# Altium schematic sheet _i2c1.SchDoc
size Tabloid
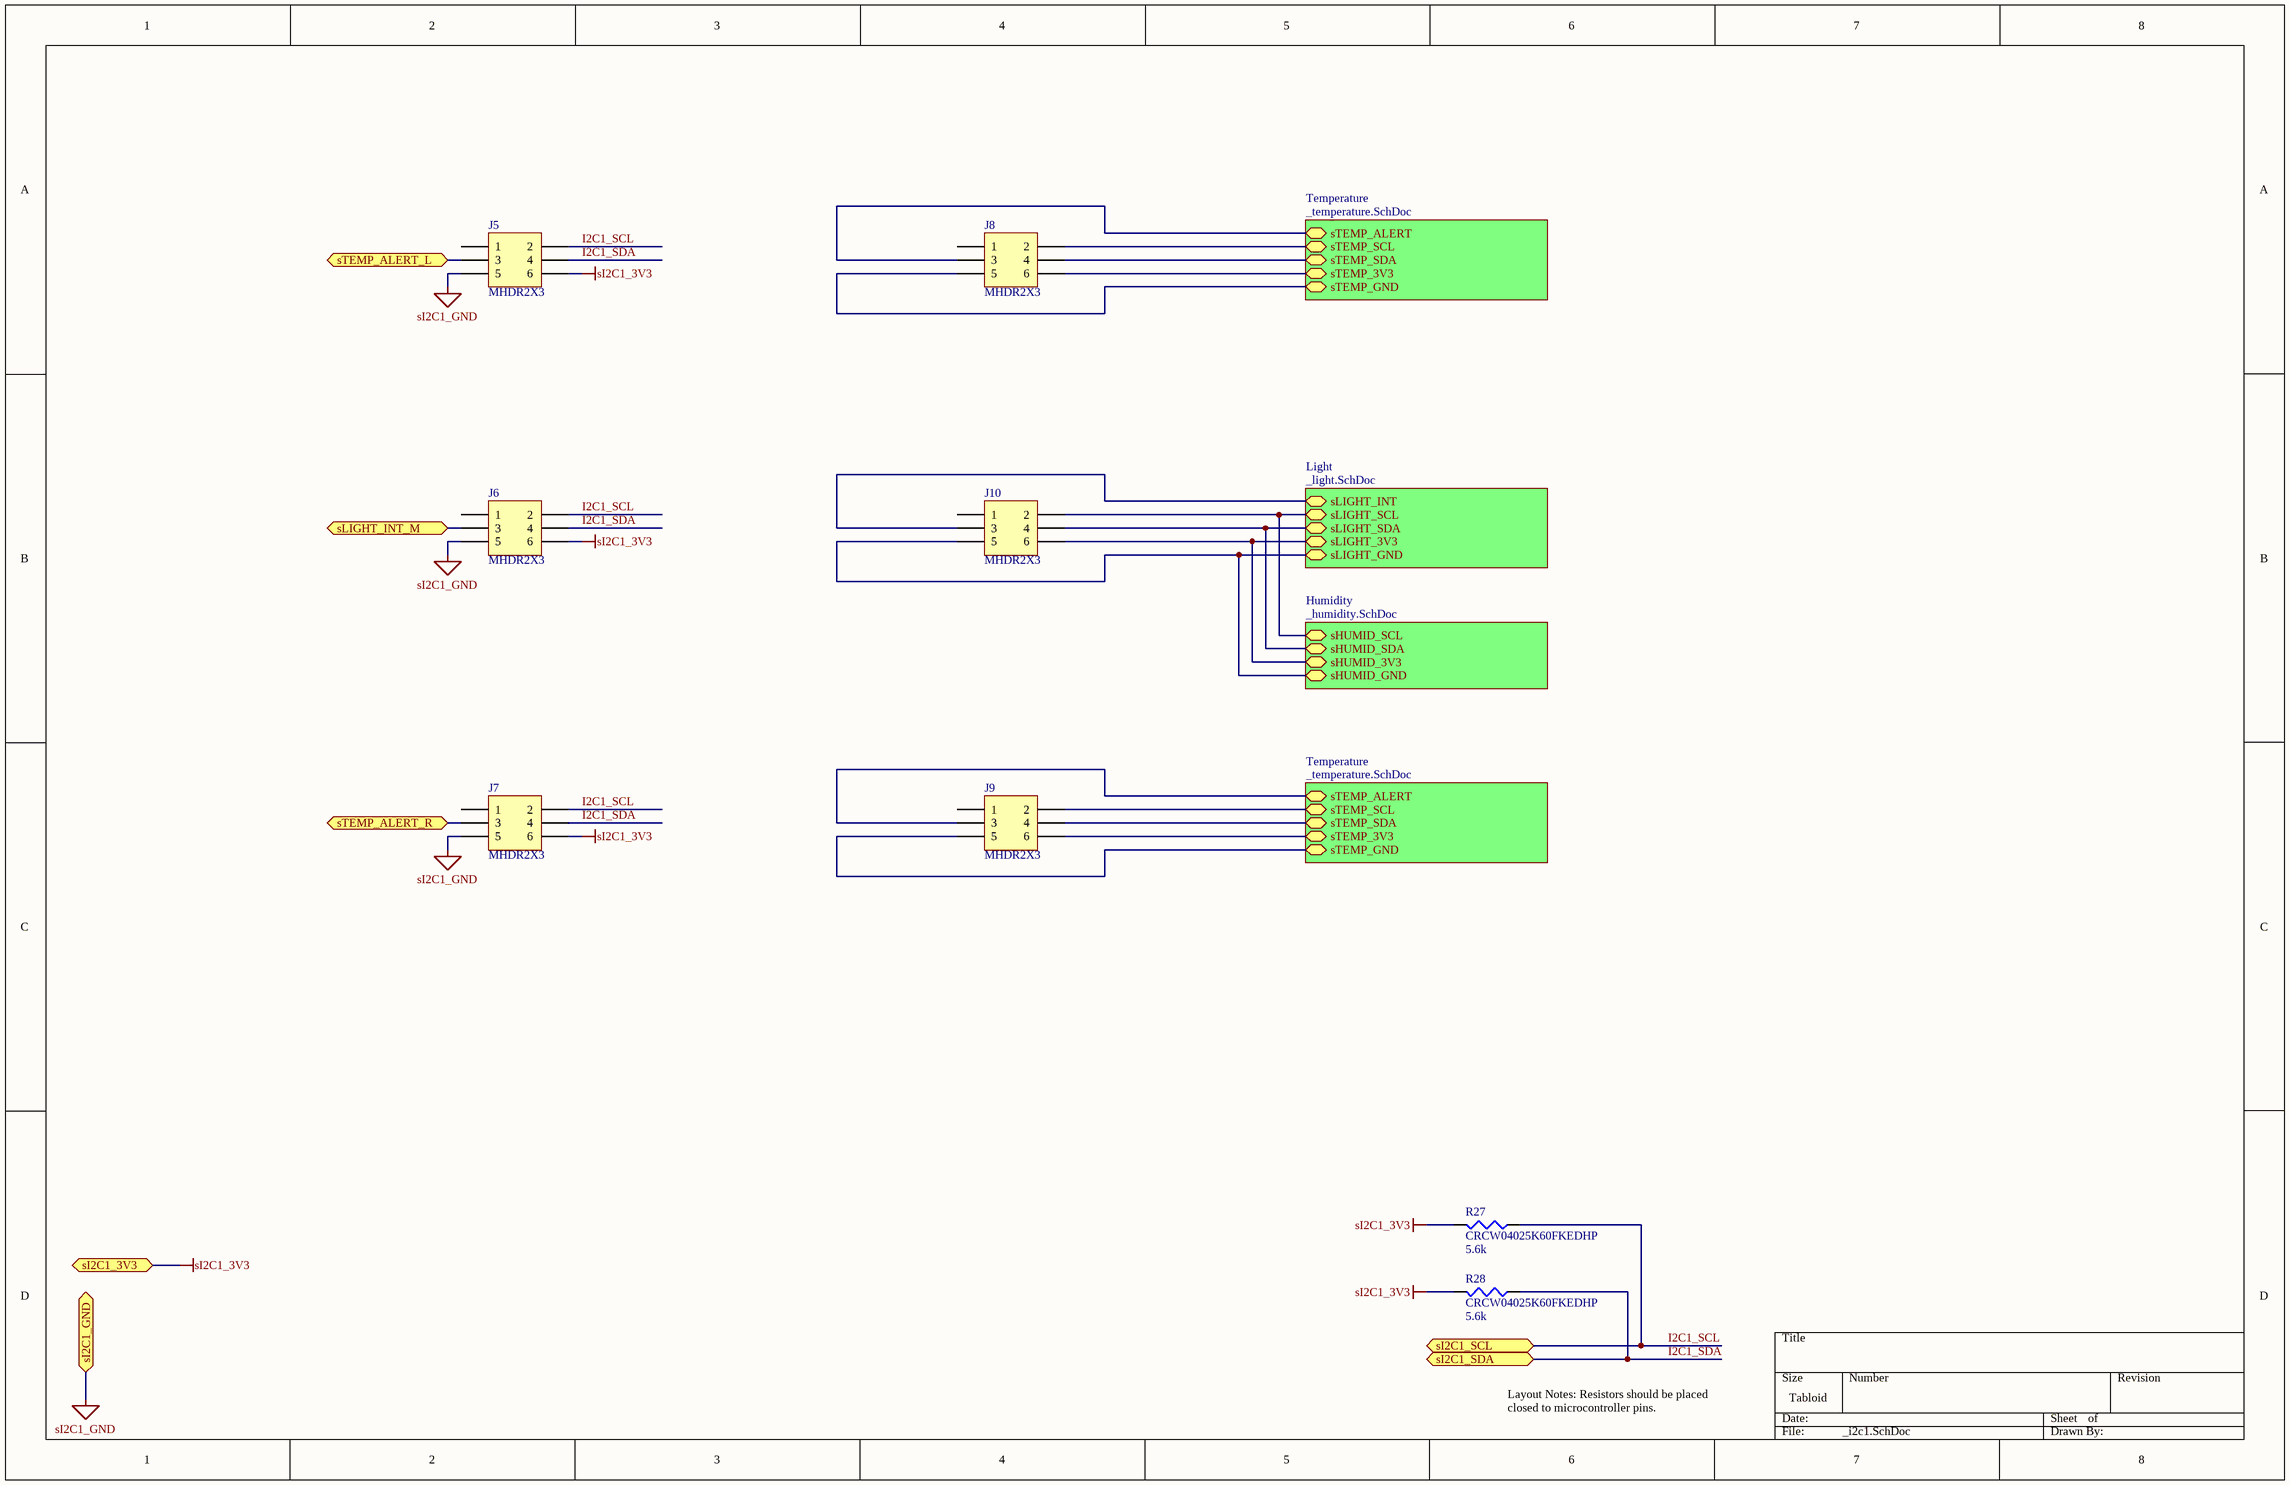
[diagram p0: _i2c1.SchDoc]

## Parts
J5  MHDR2X3  [MHDR2X3]
J6  MHDR2X3  [MHDR2X3]
J7  MHDR2X3  [MHDR2X3]
J8  MHDR2X3  [MHDR2X3]
J9  MHDR2X3  [MHDR2X3]
J10  MHDR2X3  [MHDR2X3]
R27  CRCW04025K60FKEDHP  value 5.6k  [0402]
R28  CRCW04025K60FKEDHP  value 5.6k  [0402]

## Sub-sheets
Humidity = _humidity.SchDoc: sHUMID_SCL, sHUMID_SDA, sHUMID_3V3, sHUMID_GND
Light = _light.SchDoc: sLIGHT_SCL, sLIGHT_SDA, sLIGHT_INT, sLIGHT_3V3, sLIGHT_GND
Temperature = _temperature.SchDoc: sTEMP_3V3, sTEMP_GND, sTEMP_SCL, sTEMP_SDA, sTEMP_ALERT
Temperature = _temperature.SchDoc: sTEMP_3V3, sTEMP_GND, sTEMP_SCL, sTEMP_SDA, sTEMP_ALERT

## Ports
sI2C1_3V3, sI2C1_GND, sI2C1_SCL, sI2C1_SDA, sLIGHT_INT_M, sTEMP_ALERT_L, sTEMP_ALERT_R

## Nets
sI2C1_3V3: J5.6 J6.6 J7.6 R27.2 R28.2 ; port sI2C1_3V3
sI2C1_GND: J5.5 J6.5 J7.5 ; port sI2C1_GND
I2C1_SCL: J5.2 J6.2 J7.2 R27.1 ; port sI2C1_SCL
I2C1_SDA: J5.4 J6.4 J7.4 R28.1 ; port sI2C1_SDA
sLIGHT_INT_M: J6.3 ; port sLIGHT_INT_M
sTEMP_ALERT_L: J5.3 ; port sTEMP_ALERT_L
sTEMP_ALERT_R: J7.3 ; port sTEMP_ALERT_R
NetJ8_2: J8.2 ; sheet Temperature/sTEMP_SCL
NetJ8_3: J8.3 ; sheet Temperature/sTEMP_ALERT
NetJ8_4: J8.4 ; sheet Temperature/sTEMP_SDA
NetJ8_5: J8.5 ; sheet Temperature/sTEMP_GND
NetJ8_6: J8.6 ; sheet Temperature/sTEMP_3V3
NetJ9_2: J9.2 ; sheet Temperature/sTEMP_SCL
NetJ9_3: J9.3 ; sheet Temperature/sTEMP_ALERT
NetJ9_4: J9.4 ; sheet Temperature/sTEMP_SDA
NetJ9_5: J9.5 ; sheet Temperature/sTEMP_GND
NetJ9_6: J9.6 ; sheet Temperature/sTEMP_3V3
NetJ10_2: J10.2 ; sheet Light/sLIGHT_SCL, sheet Humidity/sHUMID_SCL
NetJ10_3: J10.3 ; sheet Light/sLIGHT_INT
NetJ10_4: J10.4 ; sheet Light/sLIGHT_SDA, sheet Humidity/sHUMID_SDA
NetJ10_5: J10.5 ; sheet Light/sLIGHT_GND, sheet Humidity/sHUMID_GND
NetJ10_6: J10.6 ; sheet Light/sLIGHT_3V3, sheet Humidity/sHUMID_3V3

Not connected (* = marked no-connect by the designer): J5 1; J6 1; J7 1; J8 1; J9 1; J10 1

## Notes on the sheet
- Layout Notes: Resistors should be placed closed to microcontroller pins.

## Library data of the parts
J5-J10 = MHDR2X3: Header, 3-Pin, Dual row; LatestRevisionDate: 17-Jul-2002; LatestRevisionNote: Re-released for DXP Platform.; Publisher: Altium Limited
R27 R28 = CRCW0402xxxxFKED: 0.125W, -55-155C, 1005, 50V, ±1%